# Altium schematic sheet un5.2EGX16.schdoc
size A2
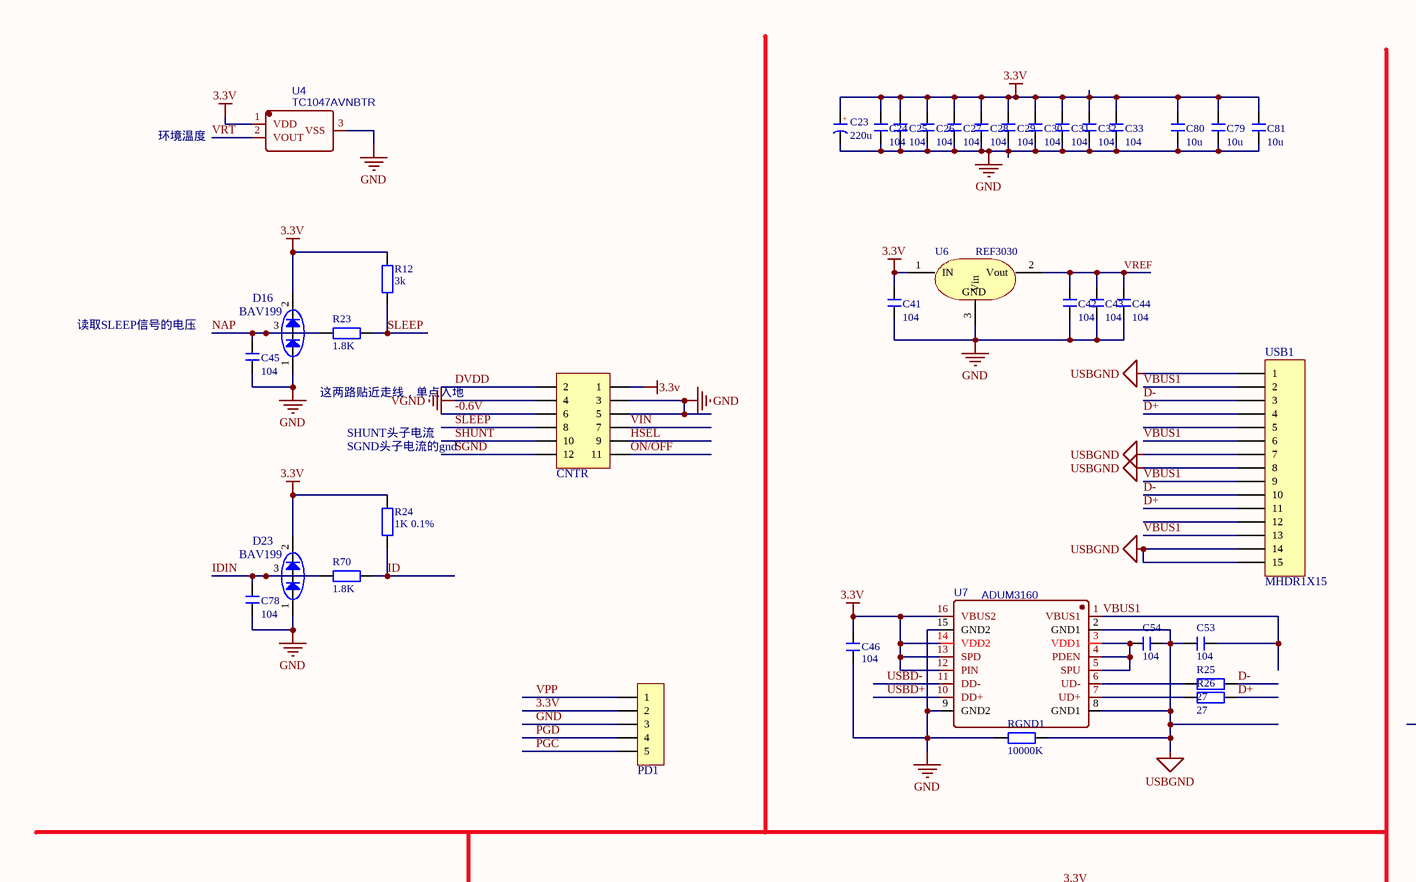
[diagram p0: un5.2EGX16.schdoc, top left]
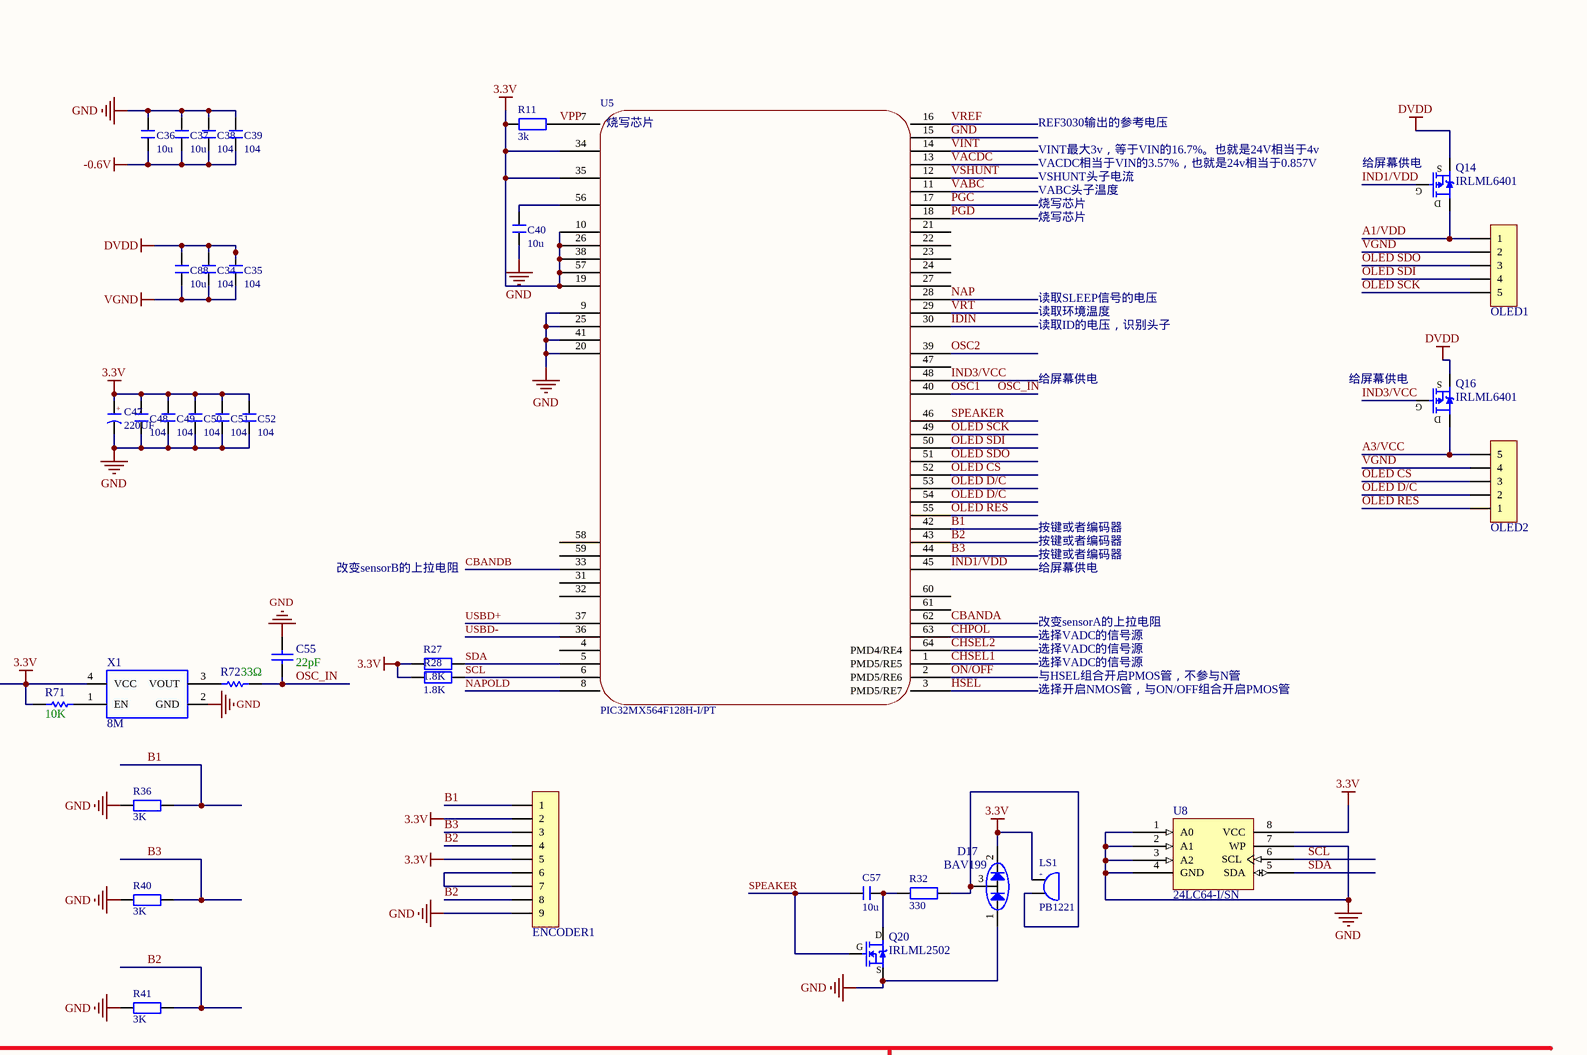
[diagram p1: un5.2EGX16.schdoc, top right]
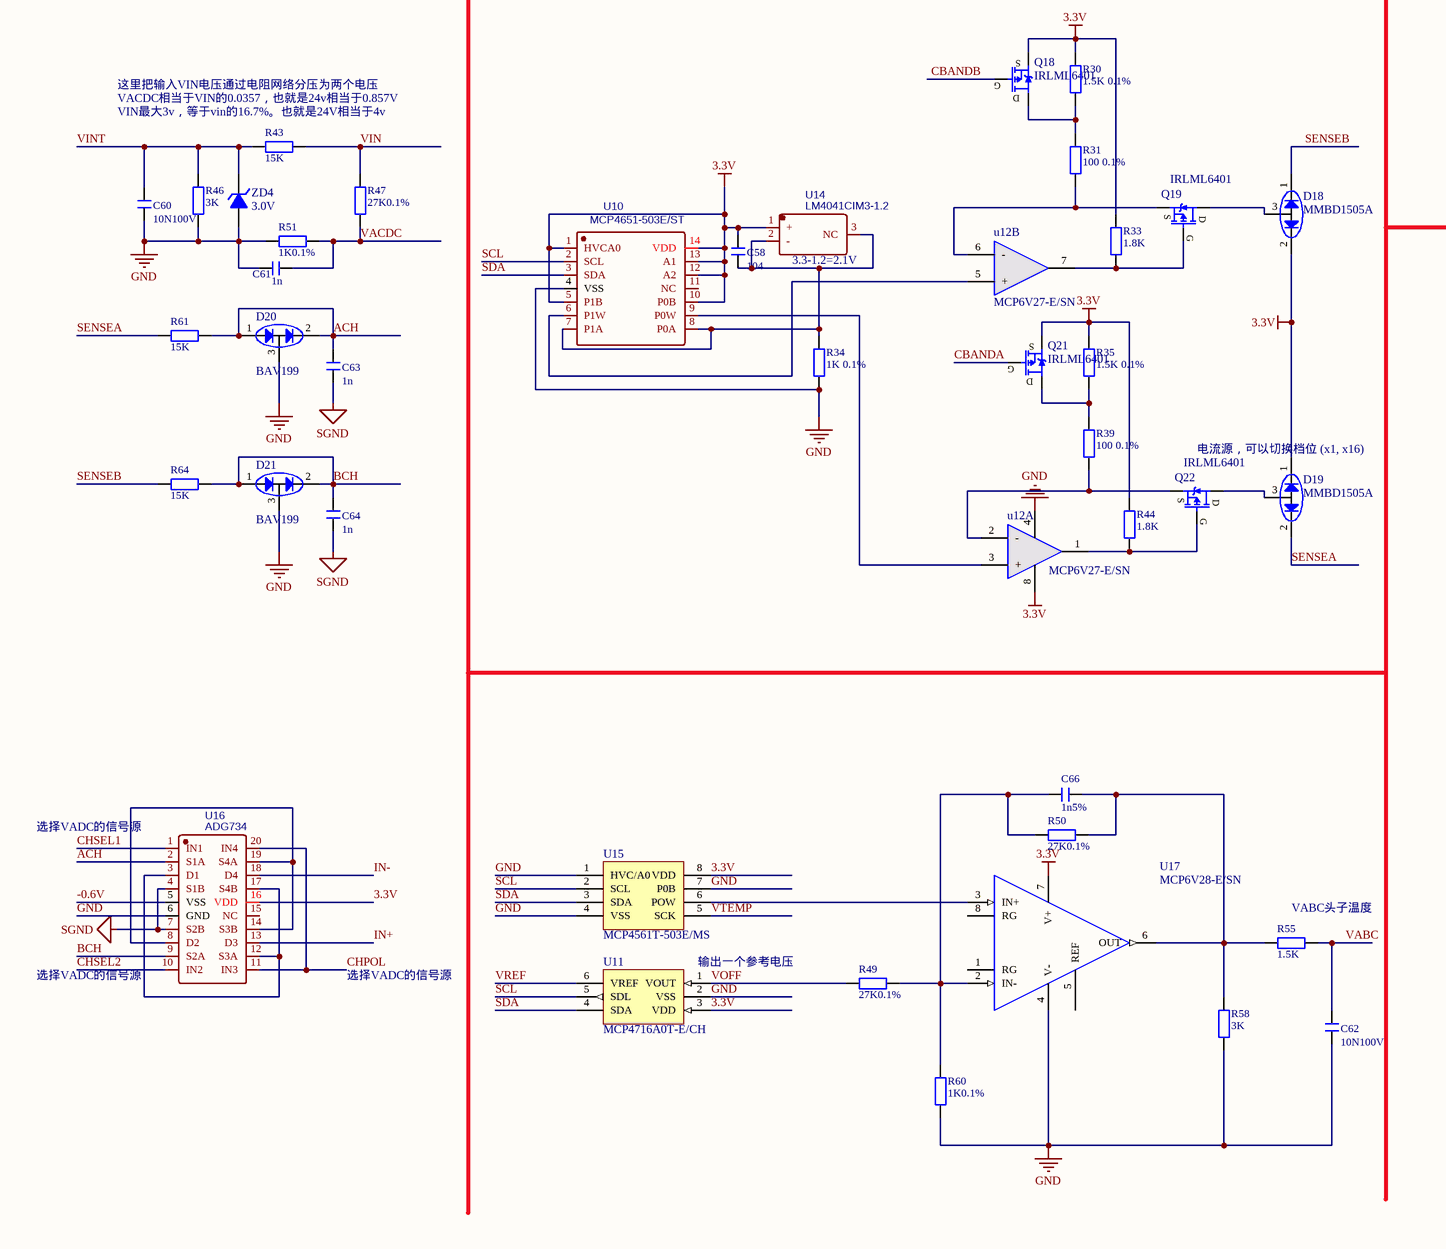
[diagram p2: un5.2EGX16.schdoc, bottom left]
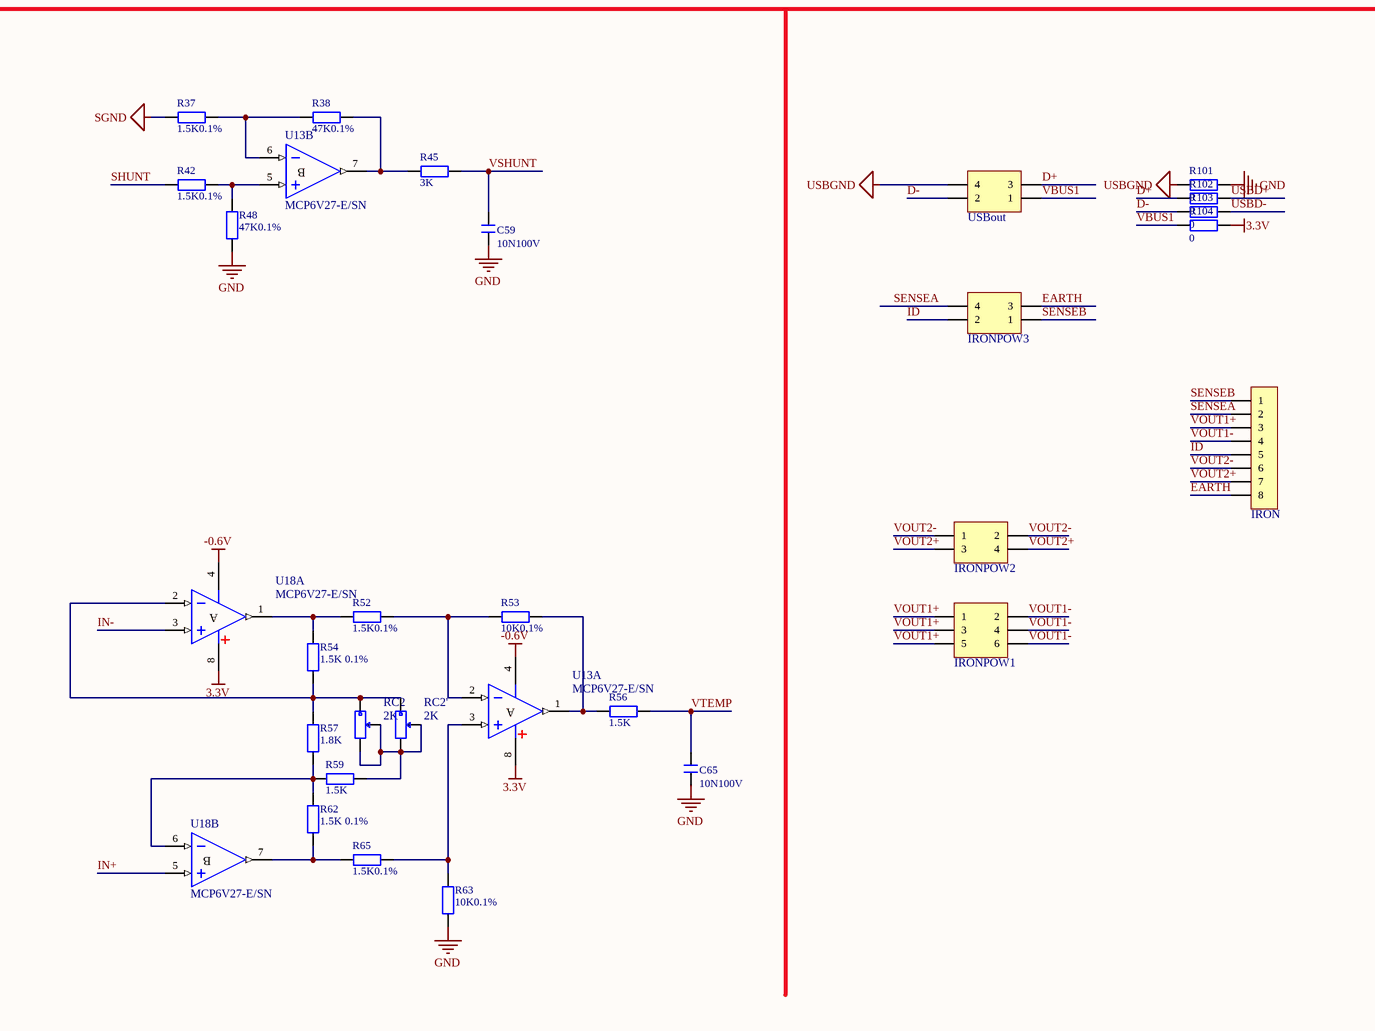
[diagram p3: un5.2EGX16.schdoc, bottom right]

## Parts
C23  220u  [CD D(7343)]
C24  104  [C 0603_L]
C25  104  [C 0603_L]
C26  104  [C 0603_L]
C27  104  [C 0603_L]
C28  104  [C 0603_L]
C29  104  [C 0603_L]
C30  104  [C 0603_L]
C31  104  [C 0603_L]
C32  104  [C 0603_L]
C33  104  [C 0603_L]
C34  104  [C 0603_L]
C35  104  [C 0603_L]
C36  10u  [C 0805_L]
C37  10u  [C 0805_L]
C38  104  [C 0603_L]
C39  104  [C 0603_L]
C40  10u  [C 0805_L]
C41  104  [C 0603_L]
C42  104  [C 0603_L]
C43  104  [C 0603_L]
C44  104  [C 0603_L]
C45  104  [C 0603_L]
C46  104  [C 0603_L]
C47  220UF  [CD D(7343)]
C48  104  [C 0603_L]
C49  104  [C 0603_L]
C50  104  [C 0603_L]
C51  104  [C 0603_L]
C52  104  [C 0603_L]
C53  104  [C 0603_L]
C54  104  [C 0603_L]
C55  22pF  [R 0805_L]
C57  10u  [C 0805_L]
C58  104  [C 0603_L]
C59  10N100V  [C 0805_L]
C60  10N100V  [C 0805_L]
C61  1n  [C 0805_L]
C62  10N100V  [C 0805_L]
C63  1n  [C 0805_L]
C64  1n  [C 0805_L]
C65  10N100V  [C 0805_L]
C66  1n5%  [C 0805_L]
C78  104  [C 0603_L]
C79  10u  [C 0805_L]
C80  10u  [C 0805_L]
C81  10u  [C 0805_L]
C88  10u  [C 0805_L]
CNTR  Header 6X2  [HDR2.54-LI-2x6P]  (value not drawn)
D16  BAV199  [SOT23-3L]
D17  BAV199  [SOT23-3L]
D18  MMBD1505A  [SOT23-3N]
D19  MMBD1505A  [SOT23-3N]
D20  BAV199  [SOT23-3N]
D21  BAV199  [SOT23-3N]
D23  BAV199  [SOT23-3L]
ENCODER1  HDR-1X9  [EC11]  (value not drawn)
IRON  HDR-1X8  [GX16-8P]  (value not drawn)
IRONPOW1  Header3X2  [HDR2.54-LI-2x3P]  (value not drawn)
IRONPOW2  Header2X2  [HDR2.54-LI-4P]  (value not drawn)
IRONPOW3  Header2X2  [HDR2.54-LI-4P]  (value not drawn)
LS1  PB1221  [MLT-5020]
OLED1  HDR-1X5  [HDR2.54-M-LI-5P]  (value not drawn)
OLED2  HDR-1X5  [HDR2.54-M-LI-5P]  (value not drawn)
PD1  HDR-1X5  [HDR1.27-LI-5P]  (value not drawn)
Q14  IRLML6401  [SOT23-3N]
Q16  IRLML6401  [SOT23-3N]
Q18  IRLML6401  [SOT23-3N]
Q19  IRLML6401  [SOT23-3N]
Q20  IRLML2502  [SOT23-3N]
Q21  IRLML6401  [SOT23-3N]
Q22  IRLML6401  [SOT23-3N]
R11  3k  [R 0805_L]
R12  3k  [R 0805_L]
R23  1.8K  [R 0805_L]
R24  1K 0.1%  [R 0805_L]
R25  27  [R 0805_L]
R26  27  [R 0805_L]
R27  1.8K  [R 0805_L]
R28  1.8K  [R 0805_L]
R30  1.5K 0.1%  [R 0805_L]
R31  100 0.1%  [R 0805_L]
R32  330  [R 0805_L]
R33  1.8K  [R 0805_L]
R34  1K 0.1%  [R 0805_L]
R35  1.5K 0.1%  [R 0805_L]
R36  3K  [R 0805_L]
R37  1.5K0.1%  [R 0805_L]
R38  47K0.1%  [R 0805_L]
R39  100 0.1%  [R 0805_L]
R40  3K  [R 0805_L]
R41  3K  [R 0805_L]
R42  1.5K0.1%  [R 0805_L]
R43  15K  [R 0805_L]
R44  1.8K  [R 0805_L]
R45  3K  [R 0805_L]
R46  3K  [R 0805_L]
R47  27K0.1%  [R 0805_L]
R48  47K0.1%  [R 0805_L]
R49  27K0.1%  [R 0805_L]
R50  27K0.1%  [R 0805_L]
R51  1K0.1%  [R 0805_L]
R52  1.5K0.1%  [R 0805_L]
R53  10K0.1%  [R 0805_L]
R54  1.5K 0.1%  [R 0805_L]
R55  1.5K  [R 0805_L]
R56  1.5K  [R 0805_L]
R57  1.8K  [R 0805_L]
R58  3K  [R 0805_L]
R59  1.5K  [R 0805_L]
R60  1K0.1%  [R 0805_L]
R61  15K  [R 0805_L]
R62  1.5K 0.1%  [R 0805_L]
R63  10K0.1%  [R 0805_L]
R64  15K  [R 0805_L]
R65  1.5K0.1%  [R 0805_L]
R70  1.8K  [R 0805_L]
R71  10K  [R 0805_L]
R72  33Ω  [R 0805_L]
R101  0  [0603]
R102  0  [0603]
R103  0  [0603]
R104  0  [0603]
RC2  2K  [3314j]
RC2'  2K  [3314j]
RGND1  10000K  [R 2512_L]
U4  TC1047AVNBTR  [SOT23-3L]
U5  PIC32MX564F128H-I/PT  [TQFP64 10X10_M]
U6  REF3030  [SOT23-3N]
U7  ADUM3160  [SOP16W_L]
U8  24LC64-I/SN  [SOP8_N]
U10  MCP4651-503E/ST  [TSSOP14_L]
U11  MCP4716A0T-E/CH  [SOT23-6]
u12  MCP6V27-E/SN  [SOP8_N]  (parts A,B of 2)
U13  MCP6V27-E/SN  [SOP8_N]  (parts A,B of 2)
U14  LM4041CIM3-1.2  [SOT23-3L]
U15  MCP4561T-503E/MS  [MSOP8_N]
U16  ADG734  [TSSOP20]
U17  MCP6V28-E/SN  [SOP8_N]
U18  MCP6V27-E/SN  [SOP8_N]  (parts A,B of 2)
USB1  MHDR1X15  [USB-TYPEC-14P]
USBout  Header2X2  [HDR2.54-LI-4P]  (value not drawn)
X1  8M  [XTAL-3225]
ZD4  3.0V  [MINI_MELF (LL34)]

## Nets
3.3V: C23.1(A) C24.1 C25.1 C26.1 C27.1 C28.1 C29.1 C30.1 C31.1 C32.1 C33.1 C41.1 C46.1 C47.1(A) C48.2 C49.2 C50.2 C51.2 C52.2 C58.1 C79.2 C80.2 C81.2 CNTR.1 D16.2 D17.2 D18.2 D19.1 D23.2 ENCODER1.2 ENCODER1.5 LS1.1 PD1.2 Q18.2(S) Q21.2(S) R11.1 R12.2 R24.2 R27.1 R28.1 R30.2 R33.2 R35.2 R44.2 R71.1 R104.2 U4.1(VDD) U5.10 U5.19 U5.26 U5.34 U5.35 U5.38 U5.57 U6.1(IN) U7.12(PIN) U7.13(SPD) U7.14(VDD2) U7.16(VBUS2) U8.8(VCC) U10.1(HVCA0) U10.5(P1B) U10.10(P0B) U10.12(A2) U10.13(A1) U10.14(VDD) U11.3(VDD) u12.8(V+) U13.8(V+) U14.1(+) U15.8(VDD) U16.16(VDD) U17.7(V+) U18.8(V+) X1.4(VCC)
-0.6V: C36.1 C37.1 C38.1 C39.1 CNTR.6 U13.4(V-) U16.5(VSS) U18.4(V-)
DVDD: C34.2 C35.2 C88.2 CNTR.2 Q14.2(S) Q16.2(S)
GND: C23.2(K) C24.2 C25.2 C26.2 C27.2 C28.2 C29.2 C30.2 C31.2 C32.2 C33.2 C36.2 C37.2 C38.2 C39.2 C40.1 C41.2 C42.2 C43.2 C44.2 C45.2 C46.2 C47.2(K) C48.1 C49.1 C50.1 C51.1 C52.1 C55.2 C59.2 C60.2 C61.1 C62.2 C65.2 C78.2 C79.1 C80.1 C81.1 CNTR.3 CNTR.5 D16.1 D17.1 D20.3 D21.3 D23.1 ENCODER1.9 PD1.3 Q20.2(S) R34.1 R36.1 R40.1 R41.1 R46.2 R48.2 R51.1 R58.2 R60.2 R63.1 R101.2 RGND1.1 U4.3(VSS) U5.9 U5.15 U5.20 U5.25 U5.41 U6.3(Vin) U7.9(GND2) U7.15(GND2) U8.1(A0) U8.2(A1) U8.3(A2) U8.4(GND) U8.7(WP) U10.4(VSS) U11.2(VSS) u12.4(V-) U15.1(HVC/A0) U15.4(VSS) U15.7(P0B) U16.6(GND) U17.4(V-) X1.2(GND) ZD4.1(A)
SGND: C63.2 C64.2 CNTR.12 R37.2 U16.4(S1B) U16.7(S2B)
USBGND: C53.2 C54.1 R101.1 RGND1.2 U7.2(GND1) U7.8(GND1) USB1.1 USB1.7 USB1.8 USB1.14 USB1.15 USBout.4
VGND: C34.1 C35.1 C88.1 CNTR.4 OLED1.2 OLED2.4
A1/VDD: OLED1.1 Q14.3(D)
A3/VCC: OLED2.5 Q16.3(D)
ACH: C63.1 D20.1 D20.2 R61.1 U16.2(S1A)
B1: ENCODER1.1 R36.2 U5.42
B2: ENCODER1.4 ENCODER1.8 R41.2 U5.43
B3: ENCODER1.3 R40.2 U5.44
BCH: C64.1 D21.1 D21.2 R64.1 U16.9(S2A)
CBANDA: Q21.1(G) U5.62
CBANDB: Q18.1(G) U5.33
CHPOL: U5.63 U16.11(IN3) U16.20(IN4)
CHSEL1: U5.1(PMD5/RE5) U16.1(IN1)
CHSEL2: U5.64(PMD4/RE4) U16.10(IN2)
D+: R26.2 R102.1 USB1.4 USB1.11 USBout.3
D-: R25.2 R103.1 USB1.3 USB1.10 USBout.2
EARTH: IRON.8 IRONPOW3.3
HSEL: CNTR.9 U5.3(PMD5/RE7)
ID: IRON.5 IRONPOW3.2 R24.1 R70.2
IDIN: C78.1 D23.3 R70.1 U5.30
IN+: U16.13(D3) U18.5(IN+)
IN-: U16.18(D4) U18.3(IN+)
IND1/VDD: Q14.1(G) U5.45
IND3/VCC: Q16.1(G) U5.48
NAP: C45.1 D16.3 R23.1 U5.28
NAPOLD: U5.8
OLED CS: OLED2.3 U5.52
OLED D/C: OLED2.2 U5.53 U5.54
OLED RES: OLED2.1 U5.55
OLED SCK: OLED1.5 U5.49
OLED SDI: OLED1.4 U5.50
OLED SDO: OLED1.3 U5.51
ON/OFF: CNTR.11 U5.2(PMD5/RE6)
OSC1: C55.1 R72.2 U5.40  [also labelled OSC_IN]
OSC2: U5.39
PGC: PD1.5 U5.17
PGD: PD1.4 U5.18
SCL: R28.2 U5.6 U8.6(SCL) U10.2(SCL) U11.5(SDL) U15.2(SCL)
SDA: R27.2 U5.5 U8.5(SDA) U10.3(SDA) U11.4(SDA) U15.3(SDA)
SENSEA: D19.2 IRON.2 IRONPOW3.4 R61.2
SENSEB: D18.1 IRON.1 IRONPOW3.1 R64.2
SHUNT: CNTR.10 R42.2
SLEEP: CNTR.8 R12.1 R23.2
SPEAKER: C57.2 Q20.1(G) U5.46
USBD+: R102.2 U5.37 U7.10(DD+)
USBD-: R103.2 U5.36 U7.11(DD-)
VABC: C62.1 R55.1 U5.11
VACDC: C61.2 R47.2 R51.2 U5.13
VBUS1: C53.1 R104.1 U7.1(VBUS1) USB1.2 USB1.6 USB1.9 USB1.13 USBout.1
VIN: CNTR.7 R43.1 R47.1
VINT: C60.1 R43.2 R46.1 U5.14 ZD4.2(K)
VOFF: R49.2 U11.1(VOUT)
VOUT1+: IRON.3 IRONPOW1.1 IRONPOW1.3 IRONPOW1.5
VOUT1-: IRON.4 IRONPOW1.2 IRONPOW1.4 IRONPOW1.6
VOUT2+: IRON.7 IRONPOW2.3 IRONPOW2.4
VOUT2-: IRON.6 IRONPOW2.1 IRONPOW2.2
VPP: PD1.1 R11.2 U5.7
VREF: C42.1 C43.1 C44.1 U5.16 U6.2(Vout) U11.6(VREF)
VRT: U4.2(VOUT) U5.29
VSHUNT: C59.1 R45.1 U5.12
VTEMP: C65.1 R56.1 U15.5(SCK)
NetC40_2: C40.2 U5.56
NetC54_2: C54.2 U7.3(VDD1) U7.4(PDEN) U7.5(SPU)
NetC57_1: C57.1 Q20.3(D) R32.1
NetC58_2: C58.2 R34.2 U10.7(P1A) U10.8(P0A) U14.2(-) U14.3(NC)
NetC66_1: C66.1 R49.1 R50.2 R60.1 U17.2(IN-)
NetC66_2: C66.2 R50.1 R55.2 R58.1 U17.6(OUT)
NetD17_3: D17.3 LS1.2 R32.2
NetD18_3: D18.3 Q19.3(D)
NetD19_3: D19.3 Q22.3(D)
NetENCODER1_6: ENCODER1.6 ENCODER1.7
NetQ18_3: Q18.3(D) R30.1 R31.2
NetQ19_1: Q19.1(G) R33.1 u12.7(OUT2)
NetQ19_2: Q19.2(S) R31.1 u12.6(-)
NetQ21_3: Q21.3(D) R35.1 R39.2
NetQ22_1: Q22.1(G) R44.1 u12.1(OUT1)
NetQ22_2: Q22.2(S) R39.1 u12.2(-)
NetR25_1: R25.1 U7.6(UD-)
NetR26_1: R26.1 U7.7(UD+)
NetR37_1: R37.1 R38.2 U13.6(IN-)
NetR38_1: R38.1 R45.2 U13.7(OUT)
NetR42_1: R42.1 R48.1 U13.5(IN+)
NetR52_1: R52.1 R53.2 U13.2(IN-)
NetR52_2: R52.2 R54.2 U18.1(OUT)
NetR53_1: R53.1 R56.2 U13.1(OUT)
NetR54_1: R54.1 R57.2 RC2.1 RC2'.1 U18.2(IN-)
NetR57_1: R57.1 R59.2 R62.2 U18.6(IN-)
NetR59_1: R59.1 RC2.2 RC2.3 RC2'.2 RC2'.3
NetR62_1: R62.1 R65.2 U18.7(OUT)
NetR63_2: R63.2 R65.1 U13.3(IN+)
NetR71_2: R71.2 X1.1(EN)
NetR72_1: R72.1 X1.3(VOUT)
NetU10_6: U10.6(P1W) u12.5(+)
NetU10_9: U10.9(P0W) u12.3(+)
NetU15_6: U15.6(POW) U17.3(IN+)
NetU16_3: U16.3(D1) U16.12(S3A) U16.17(S4B)
NetU16_8: U16.8(D2) U16.14(S3B) U16.19(S4A)

Not connected (* = marked no-connect by the designer): U5 4 21 22 23 24 27 31 32 47 58 59 60 61; U10 11(NC); U16 15(NC); U17 1(RG) 5(REF) 8(RG); USB1 5 12

## Notes on the sheet
- 环境温度
- (near U5) 烧写芯片
- REF3030输出的参考电压
- VINT最大3v，等于VIN的16.7%。也就是24V相当于4v
- VACDC相当于VIN的3.57%，也就是24v相当于0.857V
- VSHUNT头子电流
- VABC头子温度
- 烧写芯片
- (near Q14) 给屏幕供电
- 读取SLEEP信号的电压
- 读取环境温度
- 读取ID的电压，识别头子
- 这两路贴近走线，单点入地
- SHUNT头子电流
- SGND头子电流的gnd
- 给屏幕供电
- (near Q16) 给屏幕供电
- 按键或者编码器
- 改变sensorB的上拉电阻
- 选择VADC的信号源
- 与HSEL组合开启PMOS管，不参与N管
- 改变sensorA的上拉电阻
- 选择开启NMOS管，与ON/OFF组合开启PMOS管
- 这里把输入VIN电压通过电阻网络分压为两个电压
- (near R43) VACDC相当于VIN的0.0357，也就是24v相当于0.857V
- (near R43) VIN最大3v，等于vin的16.7%。也就是24V相当于4v
- (near U14) 3.3-1.2=2.1V
- 电流源，可以切换档位 (x1, x16)
- (near R55) VABC头子温度
- (near U11) 输出一个参考电压
- (in symbol 220u) +
- (in symbol 220UF) +
- (in symbol DC5V) +
- (in symbol LM358, part A) A
- (in symbol LM358, part B) B
- (in symbol REF3030) GND

## Library data of the parts
C23 = 220u: BOM名称: 贴片钽电容; 版权归属: 源创客; 学习资源: www.ooocke.com
C24-C35 C38 C39 C41-C46 C48-C54 C58-C66 C78 = 104: BOM名称: 无极性贴片电容; 版权归属: 源创客; 材质: X7R; 学习资源: www.ooocke.com
C36 C37 C40 C57 C79-C81 C88 = 10u: BOM名称: 无极性贴片电容; 版权归属: 源创客; 材质: X7R; 学习资源: www.ooocke.com
C47 = 220UF: BOM名称: 贴片钽电容; 版权归属: 源创客; 学习资源: www.ooocke.com
C55 = 6420063: Capacitor; 物料规格: 22p,50V,±5%,C0G; 物料名称: 贴片电容; 封装: 0603; 备注: C0603COG220J500NT; Published: 8-Jun-2000; LatestRevisionDate: 17-Jul-2002; LatestRevisionNote: Re-released for DXP Platform.; PackageReference: RAD-0.3; Publisher: Altium Limited; PackageDescription: Radial Cap, Thru-Hole; 2 Leads; 0.3 in Pin Spacing; 物料编码: 6420063
CNTR = Header  6X2: 6*2P接插件; 版权归属: 源创客; BOM名称: 6*2P接插件; 学习资源: www.ooocke.com
D16 D17 D20 D21 D23 = BAT54S: 表贴肖特基二极管; BOM名称: 肖特基二极管; 版权归属: 源创客; 属性: 30V/0.2A; 学习资源: www.ooocke.com
D18 D19 = BAT54A: 表贴肖特基二极管; BOM名称: 肖特基二极管; 版权归属: 源创客; 属性: 30V/0.2A; 学习资源: www.ooocke.com
ENCODER1 = Header 9: 9P接插件; 版权归属: 源创客; BOM名称: 9P接插件; 学习资源: www.ooocke.com
IRON = Header 8: 8P接插件; 版权归属: 源创客; BOM名称: 8P接插件; 学习资源: www.ooocke.com
IRONPOW1 = Header 3X2: 3*2P接插件; 版权归属: 源创客; BOM名称: 3*2P接插件; 学习资源: www.ooocke.com
IRONPOW2 IRONPOW3 USBout = Header 2X2: 2*2P接插件; 版权归属: 源创客; BOM名称: 2*2P接插件; 学习资源: www.ooocke.com
LS1 = DC5V: BOM名称: 蜂鸣器; 版权归属: 源创客; 学习资源: www.ooocke.com
OLED1 OLED2 PD1 = Header 5: 5P接插件; 版权归属: 源创客; BOM名称: 5P接插件; 学习资源: www.ooocke.com
Q14 Q16 Q18 Q19 Q21 Q22 = AO3401: P沟道 30V/4.2A; BOM名称: 场效应管; 版权归属: 源创客; 学习资源: www.ooocke.com; 描述: P沟道 30V/4.2A
Q20 = AO3400: N沟道 30V/4.2A; BOM名称: 场效应管; 版权归属: 源创客; 学习资源: www.ooocke.com; 描述: N沟道 30V/4.2A
R11 = 3k: BOM名称: 贴片电阻; 版权归属: 源创客; 学习资源: www.ooocke.com
R12 R23-R26 R30-R65 R70 RGND1 = 330: BOM名称: 贴片电阻; 版权归属: 源创客; 学习资源: www.ooocke.com
R27 R28 R101-R104 = 1.8K: BOM名称: 贴片电阻; 版权归属: 源创客; 学习资源: www.ooocke.com
R71 = 6350004: Resistor（贴片）; 物料规格: 10KΩ,5%,1/10W; 物料名称: 贴片电阻; 封装: 0603; 备注: R0603K1002J; Published: 8-Jun-2000; LatestRevisionDate: 29-May-2009; LatestRevisionNote: IPC-7351 Footprint Added.; PackageReference: J1-0603; Publisher: Altium Limited; PackageDescription: Chip Resistor; 物料编码: 6350004
R72 = 6320121: Resistor（贴片）; 物料规格: 33Ω，5%,1/8W; 物料名称: 贴片电阻; 封装: 0603; Published: 8-Jun-2000; LatestRevisionDate: 29-May-2009; LatestRevisionNote: IPC-7351 Footprint Added.; PackageReference: J1-0603; Publisher: Altium Limited; PackageDescription: Chip Resistor; 物料编码: 6320121
RC2 RC2' = RP-SMD: 贴片电位器; 版权归属: 源创客; BOM名称: 贴片电位器; 学习资源: www.ooocke.com
U4 U14 = LM4041CIM3-1.2/NOPB: BOM_Manufacturer: Texas Instruments; Contributor: LCSC; SMT Type: Extend; BOM_Supplier: LCSC; BOM_Supplier Part: C205904; BOM_Manufacturer Part: LM4041CIM3-1.2/NOPB; BOM_JLCPCB SMD: Yes; spicePre: U; spiceSymbolName: LM4041CIM3-1.2/NOPB
U6 = REF3030: BOM名称: 低压差线性稳压芯片; 版权归属: 源创客; 学习资源: www.ooocke.com
U7 = ADUM3160BRWZ: BOM_Manufacturer: ADI; Contributor: LCSC; SMT Type: Extend; BOM_Supplier: LCSC; BOM_Manufacturer Part: ADUM3160BRWZ; BOM_Supplier Part: C108501; BOM_JLCPCB SMD: Yes; spicePre: U; spiceSymbolName: ADUM3160BRWZ
U8 = 24Cxx: 外置EEPROM; 版权归属: 源创客; BOM名称: 外置EEPROM; 学习资源: www.ooocke.com
U10 = MCP4651-503E/ST: BOM_Manufacturer: MICROCHIP; Contributor: LCSC; SMT Type: Extend; BOM_Supplier: LCSC; BOM_Manufacturer Part: MCP4651-503E/ST; BOM_Supplier Part: C148010; BOM_JLCPCB SMD: Yes; spicePre: U; spiceSymbolName: MCP4651-503E/ST
U11 = AS179-92: 射频开关芯片; 版权归属: 源创客; BOM名称: 射频开关芯片; 学习资源: www.ooocke.com
u12 = AD8667: 双运放; 版权归属: 源创客; BOM名称: 双运放; 学习资源: www.ooocke.com
U13 U18 = LM358: 双路运放; 版权归属: 源创客; BOM名称: 双路运放; 学习资源: www.ooocke.com
U15 = MAX6675: K型热电偶检测芯片; 版权归属: 源创客; BOM名称: K型热电偶检测芯片; 学习资源: www.ooocke.com
U16 = ADG734BRUZ-REEL: BOM_Manufacturer: Analog Devices; Contributor: LCSC; SMT Type: Extend; BOM_Supplier: LCSC; BOM_Supplier Part: C579105; BOM_Manufacturer Part: ADG734BRUZ-REEL; BOM_JLCPCB SMD: Yes; spicePre: U; spiceSymbolName: ADG734BRUZ-REEL
U17 = INA122: 微功耗仪表运放; 版权归属: 源创客; BOM名称: 微功耗仪表运放; 学习资源: www.ooocke.com
USB1 = MHDR1X15: Header, 15-Pin; LatestRevisionDate: 17-Jul-2002; LatestRevisionNote: Re-released for DXP Platform.; Publisher: Altium Limited
X1 = XTAL-8M: 8M有源晶振
ZD4 = 1N4733: 5.1V/1W稳压管; 版权归属: 源创客; BOM名称: 5.1V/1W稳压管; 学习资源: www.ooocke.com